# Altium schematic sheet clock_core.SchDoc
size 594 x 420 mm; SheetNumber: 2; SheetTotal: 4
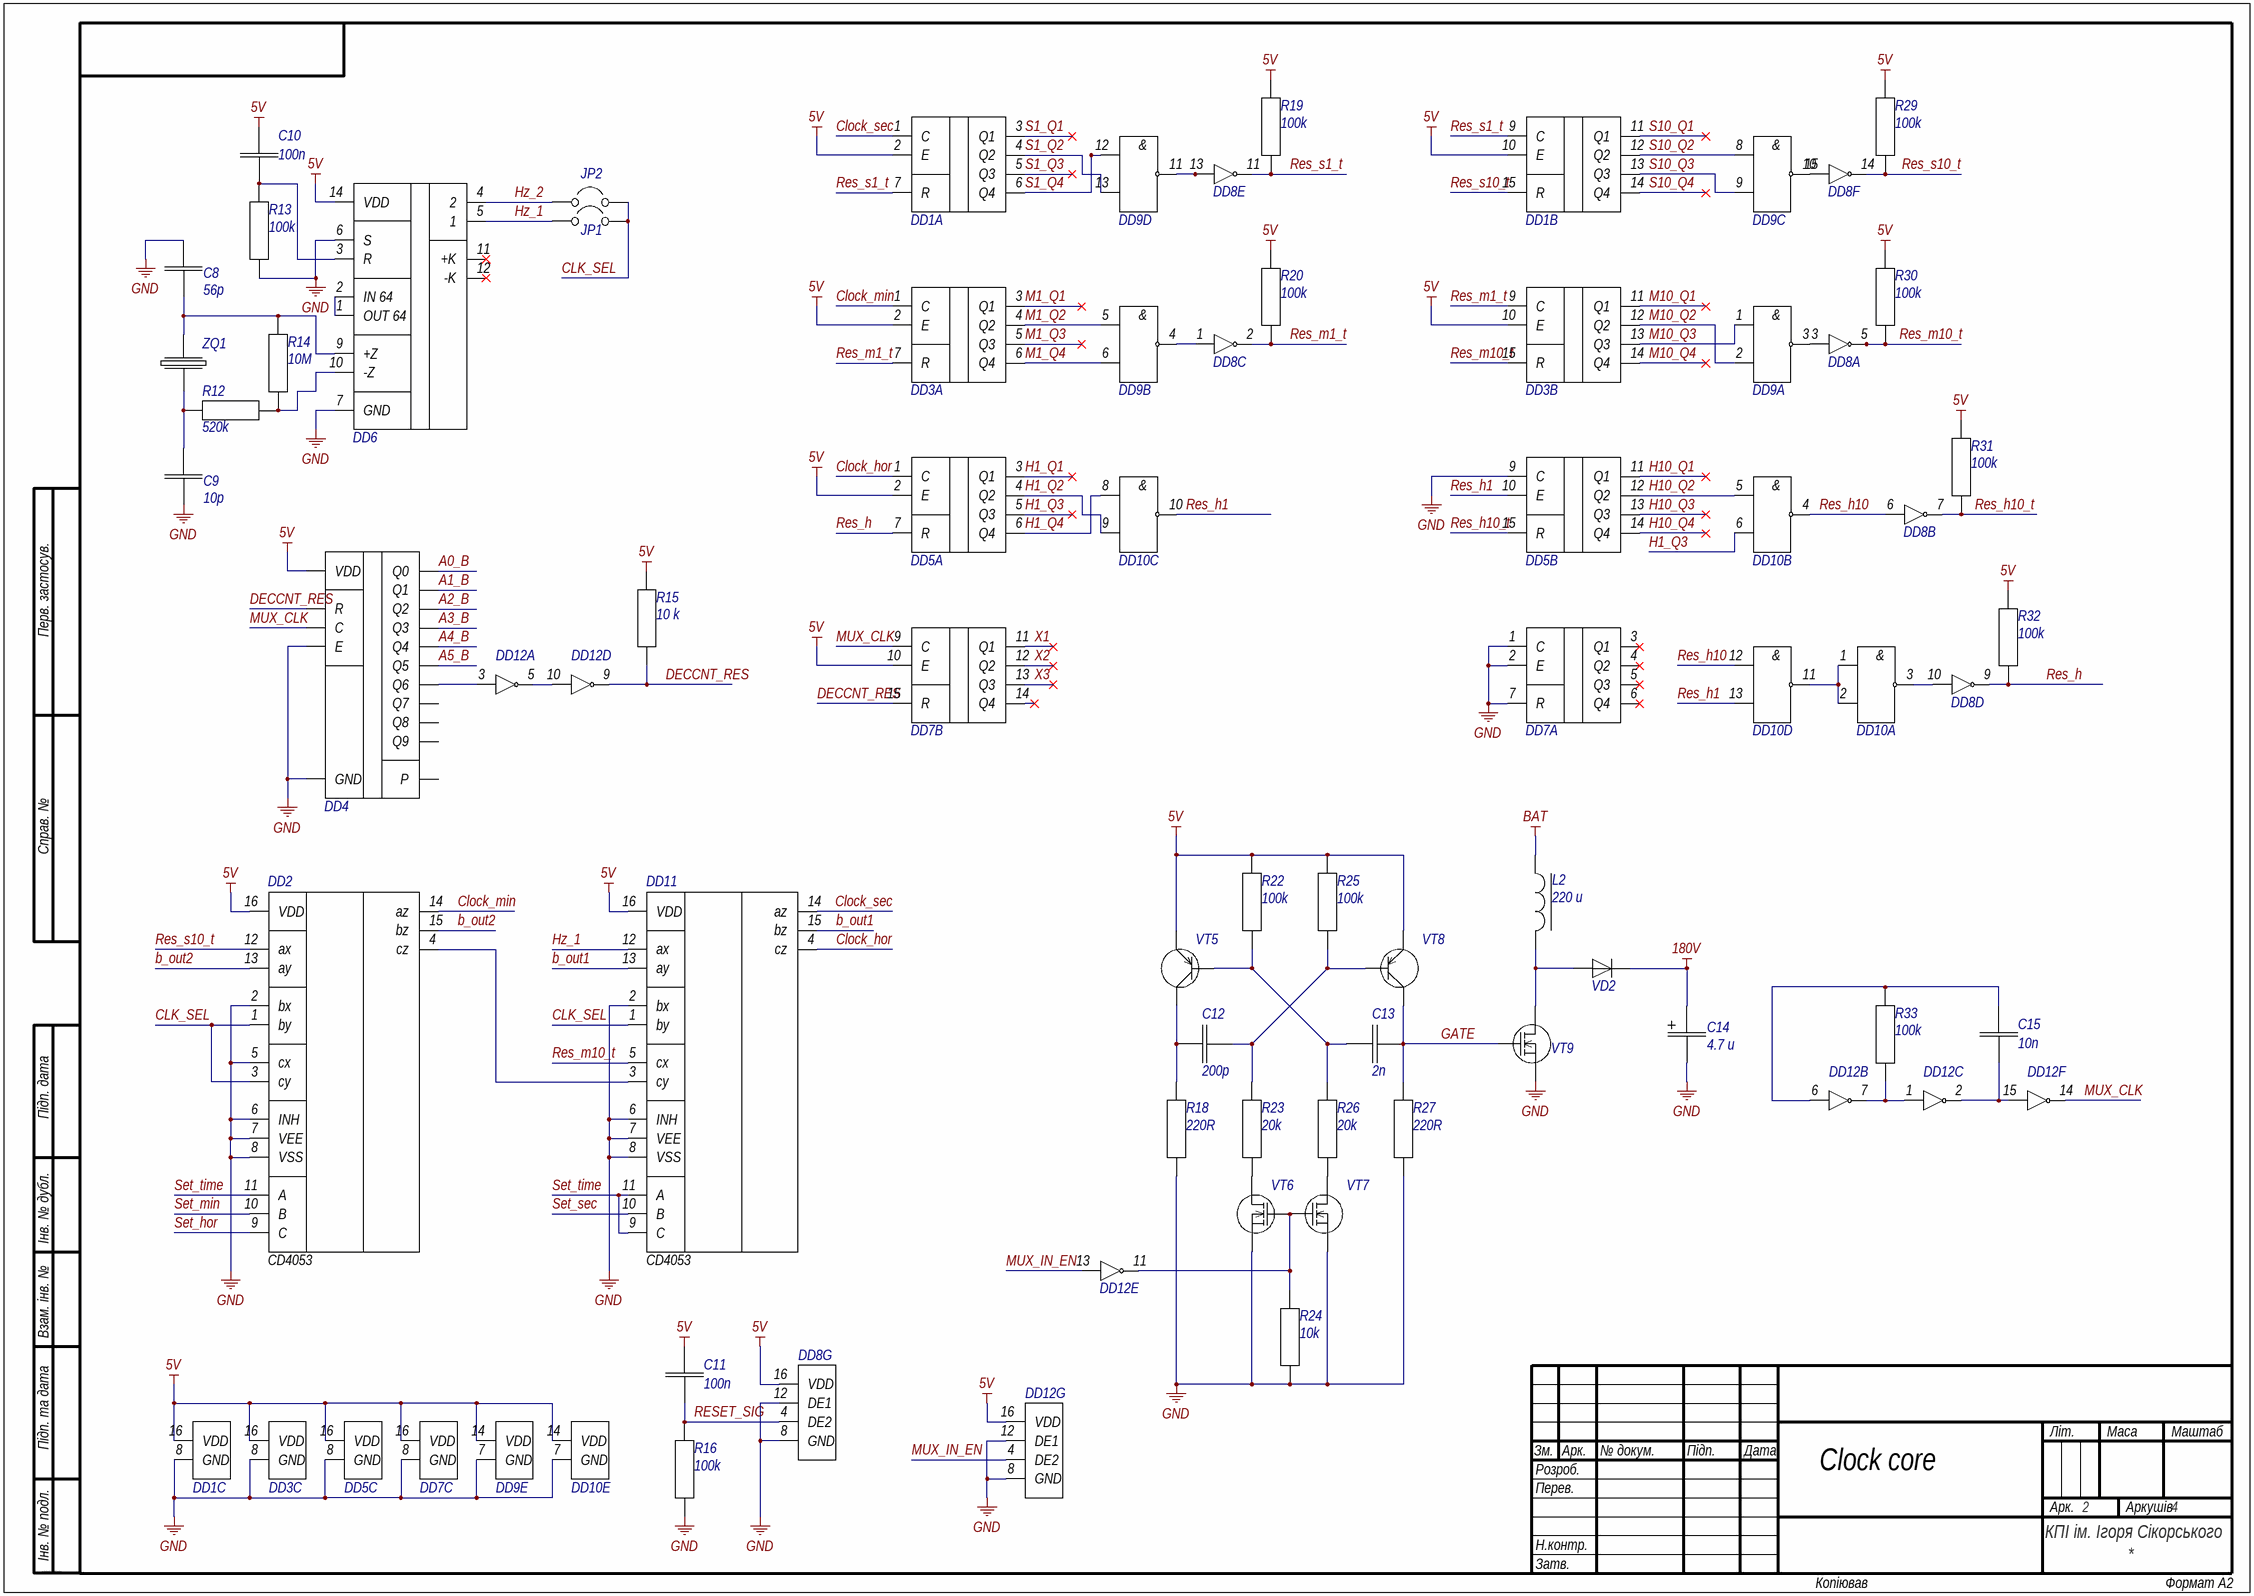
[diagram p0: clock_core.SchDoc]

## Parts
C8  value 56p  [CAP_THT]  (hidden comment: C)
C9  value 10p  [CAP_THT]  (hidden comment: C)
C10  value 100n  [CAP_THT]  (hidden comment: C)
C11  value 100n  [CAP_THT]  (hidden comment: C)
C12  value 200p  [CAP_THT]  (hidden comment: C)
C13  value 2n  [CAP_THT]  (hidden comment: C)
C14  value 4.7 u  [CAP_HIGH_VOLT]  (hidden comment: C+)
C15  value 10n  [CAP_THT]  (hidden comment: C)
DD1  К561ИЕ10  [DIP-16]  (value not drawn)  (parts A,B,C of 3)
DD2  CD4053  [DIP-16]
DD3  К561ИЕ10  [DIP-16]  (value not drawn)  (parts A,B,C of 3)
DD4  К561ИЕ8  [DIP-16]  (value not drawn)
DD5  К561ИЕ10  [DIP-16]  (value not drawn)  (parts A,B,C of 3)
DD6  К176ИЕ5  [DIP-14]  (value not drawn)
DD7  К561ИЕ10  [DIP-16]  (value not drawn)  (parts A,B,C of 3)
DD8  К561ЛН1  [DIP-16]  (value not drawn)  (parts A,B,C,D,E,F,G of 7)
DD9  К561ЛА7  [DIP-14]  (value not drawn)  (parts A,B,C,D,E of 5)
DD10  К561ЛА7  [DIP-14]  (value not drawn)  (parts A,B,C,D,E of 5)
DD11  CD4053  [DIP-16]
DD12  К561ЛН1  [DIP-16]  (value not drawn)  (parts A,B,C,D,E,F,G of 7)
JP1  Jumper  [JP]  (value not drawn)  (no BOM)
JP2  Jumper  [JP]  (value not drawn)  (no BOM)
L2  value 220 u  [IND]  (hidden comment: L)
R12  value 520k  [RES-DIP-V]  (hidden comment: R)
R13  value 100k  [RES-DIP]  (hidden comment: R)
R14  value 10M  [RES-DIP-V]  (hidden comment: R)
R15  value 10 k  [RES-DIP]  (hidden comment: R)
R16  value 100k  [RES-DIP]  (hidden comment: R)
R18  value 220R  [RES-DIP-V]  (hidden comment: R)
R19  value 100k  [RES-DIP]  (hidden comment: R)
R20  value 100k  [RES-DIP]  (hidden comment: R)
R22  value 100k  [RES-DIP-V]  (hidden comment: R)
R23  value 20k  [RES-DIP-V]  (hidden comment: R)
R24  value 10k  [RES-DIP]  (hidden comment: R)
R25  value 100k  [RES-DIP-V]  (hidden comment: R)
R26  value 20k  [RES-DIP-V]  (hidden comment: R)
R27  value 220R  [RES-DIP-V]  (hidden comment: R)
R29  value 100k  [RES-DIP]  (hidden comment: R)
R30  value 100k  [RES-DIP]  (hidden comment: R)
R31  value 100k  [RES-DIP]  (hidden comment: R)
R32  value 100k  [RES-DIP]  (hidden comment: R)
R33  value 100k  [RES-DIP]  (hidden comment: R)
VD2  1N4148  [1N4148]  (value not drawn)
VT5  BC327  [BC327]  (value not drawn)
VT6  2N7000  [2N7000]  (value not drawn)
VT7  2N7000  [2N7000]  (value not drawn)
VT8  BC327  [BC327]  (value not drawn)
VT9  IRF840  [IRF840]  (value not drawn)
ZQ1  HZ  [HZ]  (value not drawn)

## Nets
5V: C10.2 C11.2 DD1.2(E) DD1.10(E) DD1.16(VDD) DD2.16(VDD) DD3.2(E) DD3.10(E) DD3.16(VDD) DD4.16(VDD) DD5.2(E) DD5.16(VDD) DD6.14(VDD) DD7.10(E) DD7.16(VDD) DD8.16(VDD) DD9.14(VDD) DD10.14(VDD) DD11.16(VDD) DD12.16(VDD) R15.2 R19.2 R20.2 R22.2 R25.2 R29.2 R30.2 R31.1 R32.2 VT5.3(E) VT8.3(E)
180V: C14.1 VD2.1(K)
BAT: L2.1
GND: C8.2 C9.1 C14.2 DD1.8(GND) DD2.2(bx) DD2.5(cx) DD2.6(INH) DD2.7(VEE) DD2.8(VSS) DD3.8(GND) DD4.8(GND) DD4.13(E) DD5.8(GND) DD5.9(C) DD6.6(S) DD6.7(GND) DD7.1(C) DD7.2(E) DD7.7(R) DD7.8(GND) DD8.8(GND) DD8.12(DE1) DD9.7(GND) DD10.7(GND) DD11.2(bx) DD11.6(INH) DD11.7(VEE) DD11.8(VSS) DD12.8(GND) DD12.12(DE1) R13.1 R16.1 R18.1 R24.1 R27.1 VT6.1(S) VT7.1(S) VT9.3(S)
A0_B: DD4.3(Q0)
A1_B: DD4.2(Q1)
A2_B: DD4.4(Q2)
A3_B: DD4.7(Q3)
A4_B: DD4.10(Q4)
A5_B: DD4.1(Q5)
b_out1: DD11.13(ay) DD11.15(bz)
b_out2: DD2.13(ay) DD2.15(bz)
CLK_SEL: DD2.1(by) DD2.3(cy) DD11.1(by) JP1.2 JP2.2
Clock_hor: DD5.1(C) DD11.4(cz)
Clock_min: DD2.14(az) DD3.1(C)
Clock_sec: DD1.1(C) DD11.14(az)
DECCNT_RES: DD4.15(R) DD7.15(R) DD12.9(OUT4) R15.1
GATE: C13.2 R27.2 VT8.1(C) VT9.1(G)
H1_Q1: DD5.3(Q1)
H1_Q2: DD5.4(Q2) DD10.9
H1_Q3: DD5.5(Q3) DD10.6
H1_Q4: DD5.6(Q4) DD10.8
H10_Q1: DD5.11(Q1)
H10_Q2: DD5.12(Q2) DD10.5
H10_Q3: DD5.13(Q3)
H10_Q4: DD5.14(Q4)
Hz_1: DD6.5(1) DD11.12(ax) JP1.1
Hz_2: DD6.4(2) JP2.1
M1_Q1: DD3.3(Q1)
M1_Q2: DD3.4(Q2) DD9.5
M1_Q3: DD3.5(Q3)
M1_Q4: DD3.6(Q4) DD9.6
M10_Q1: DD3.11(Q1)
M10_Q2: DD3.12(Q2) DD9.2
M10_Q3: DD3.13(Q3) DD9.1
M10_Q4: DD3.14(Q4)
MUX_CLK: DD4.14(C) DD7.9(C) DD12.14(OUT6)
MUX_IN_EN: DD12.4(DE2) DD12.13(IN5)
Res_h: DD5.7(R) DD8.9(OUT4) R32.1
Res_h1: DD5.10(E) DD10.10 DD10.13
Res_h10: DD8.6(IN2) DD10.4 DD10.12
Res_h10_t: DD5.15(R) DD8.7(OUT2) R31.2
Res_m1_t: DD3.7(R) DD3.9(C) DD8.2(OUT3) R20.1
Res_m10_t: DD3.15(R) DD8.5(OUT1) DD11.5(cx) R30.1
Res_s1_t: DD1.7(R) DD1.9(C) DD8.11(OUT5) R19.1
Res_s10_t: DD1.15(R) DD2.12(ax) DD8.14(OUT6) R29.1
RESET_SIG: C11.1 DD8.4(DE2) R16.2
S1_Q1: DD1.3(Q1)
S1_Q2: DD1.4(Q2) DD9.13
S1_Q3: DD1.5(Q3)
S1_Q4: DD1.6(Q4) DD9.12
S10_Q1: DD1.11(Q1)
S10_Q2: DD1.12(Q2) DD9.8
S10_Q3: DD1.13(Q3) DD9.9
S10_Q4: DD1.14(Q4)
Set_hor: DD2.9(C)
Set_min: DD2.10(B)
Set_sec: DD11.10(B)
Set_time: DD2.11(A) DD11.9(C) DD11.11(A)
X1: DD7.11(Q1)
X2: DD7.12(Q2)
X3: DD7.13(Q3)
NetC8_1: C8.1 DD6.9(+Z) R14.2 ZQ1.2
NetC9_2: C9.2 R12.1 ZQ1.1
NetC10_1: C10.1 DD6.3(R) R13.2
NetC12_1: C12.1 R18.2 VT5.1(C)
NetC12_2: C12.2 R23.2 R25.1 VT8.2(B)
NetC13_1: C13.1 R22.1 R26.2 VT5.2(B)
NetC15_1: C15.1 DD12.6(IN2) R33.2
NetC15_2: C15.2 DD12.2(OUT3) DD12.15(IN6)
NetDD2_4: DD2.4(cz) DD11.3(cy)
NetDD4_5: DD4.5(Q6) DD12.3(IN1)
NetDD6_1: DD6.1(OUT_64) DD6.2(IN_64)
NetDD6_10: DD6.10(-Z) R12.2 R14.1
NetDD8_1: DD8.1(IN3) DD9.4
NetDD8_3: DD8.3(IN1) DD9.3
NetDD8_10: DD8.10(IN4) DD10.3
NetDD8_13: DD8.13(IN5) DD9.11
NetDD8_15: DD8.15(IN6) DD9.10
NetDD10_1: DD10.1 DD10.2 DD10.11
NetDD12_1: DD12.1(IN3) DD12.7(OUT2) R33.1
NetDD12_5: DD12.5(OUT1) DD12.10(IN4)
NetDD12_11: DD12.11(OUT5) R24.2 VT6.2(G) VT7.2(G)
NetL2_2: L2.2 VD2.2(A) VT9.2(D)
NetR23_1: R23.1 VT6.3(D)
NetR26_1: R26.1 VT7.3(D)

Not connected (* = marked no-connect by the designer): DD4 6(Q7) 9(Q8) 11(Q9) 12(P); DD6 11(+K)* 12(-K)*; DD7 3(Q1)* 4(Q2)* 5(Q3)* 6(Q4)* 14(Q4)*

## Notes on the sheet
- Clock core
- Перв. застосув.
- Справ. №
- Підп. дата
- Інв. № дубл.
- Взам. інв. №
- Підп. та дата
- Зм.
- Розроб.
- Арк.
- № докум.
- Підп.
- Дата
- Літ.
- Маса
- Маштаб
- Перев.
- Аркушів
- Інв. № подл.
- Н.контр.
- Затв.
- КПІ ім. Ігоря Сікорського
- ALTIUM GOSTBOM2.0 KEV
- Копіював
- Формат А2
- (in symbol К561ЛА7, part A) &
- (in symbol К561ЛА7, part B) &
- (in symbol К561ЛА7, part C) &
- (in symbol К561ЛА7, part D) &

## Library data of the parts
DD2 DD11 = CD4053: Name: CD4053